# EAGLE design controler (EAGLE 5.10)
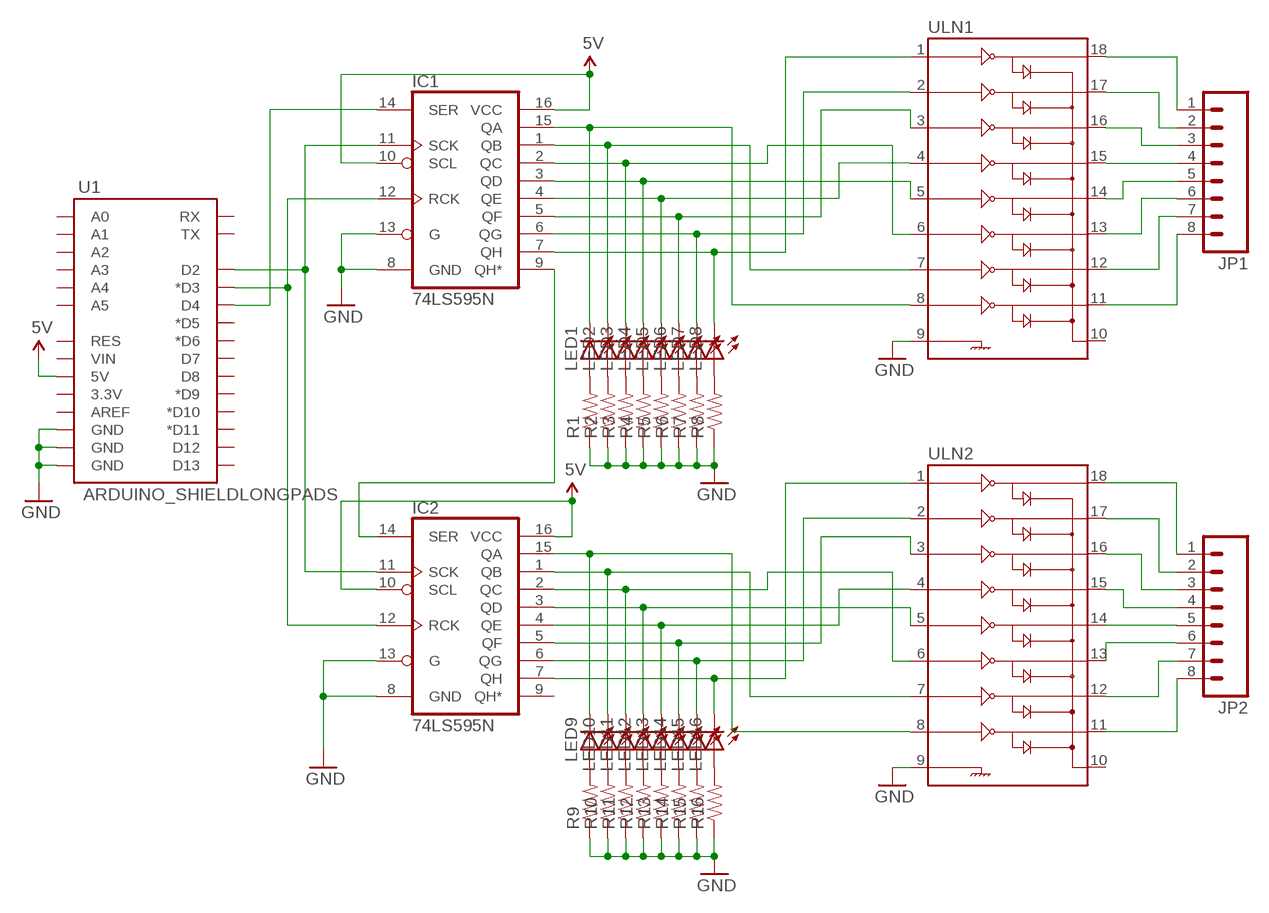
[diagram p0: schematic, sheet 1]

## Parts
IC1  74LS595N  [DIL16]
IC2  74LS595N  [DIL16]
JP1  M08  [1X08]
JP2  M08  [1X08]
LED1  LEDCHIPLED_0805  [CHIPLED_0805]
LED2  LEDCHIPLED_0805  [CHIPLED_0805]
LED3  LEDCHIPLED_0805  [CHIPLED_0805]
LED4  LEDCHIPLED_0805  [CHIPLED_0805]
LED5  LEDCHIPLED_0805  [CHIPLED_0805]
LED6  LEDCHIPLED_0805  [CHIPLED_0805]
LED7  LEDCHIPLED_0805  [CHIPLED_0805]
LED8  LEDCHIPLED_0805  [CHIPLED_0805]
LED9  LEDCHIPLED_0805  [CHIPLED_0805]
LED10  LEDCHIPLED_0805  [CHIPLED_0805]
LED11  LEDCHIPLED_0805  [CHIPLED_0805]
LED12  LEDCHIPLED_0805  [CHIPLED_0805]
LED13  LEDCHIPLED_0805  [CHIPLED_0805]
LED14  LEDCHIPLED_0805  [CHIPLED_0805]
LED15  LEDCHIPLED_0805  [CHIPLED_0805]
LED16  LEDCHIPLED_0805  [CHIPLED_0805]
R1  RESISTOR  [0805]
R2  RESISTOR  [0805]
R3  RESISTOR  [0805]
R4  RESISTOR  [0805]
R5  RESISTOR  [0805]
R6  RESISTOR  [0805]
R7  RESISTOR  [0805]
R8  RESISTOR  [0805]
R9  RESISTOR  [0805]
R10  RESISTOR  [0805]
R11  RESISTOR  [0805]
R12  RESISTOR  [0805]
R13  RESISTOR  [0805]
R14  RESISTOR  [0805]
R15  RESISTOR  [0805]
R16  RESISTOR  [0805]
U1  ARDUINO_SHIELDLONGPADS  [DUEMILANOVE_SHIELD_LONGPADS]
ULN1  ULN2803DIP  [DIL18]
ULN2  ULN2803DIP  [DIL18]

## Nets
5V: IC1.10(SCL) IC1.16(VCC) IC2.10(SCL) IC2.16(VCC) U1.5V
GND: IC1.8(GND) IC1.13(G) IC2.8(GND) IC2.13(G) R1.1 R2.1 R3.1 R4.1 R5.1 R6.1 R7.1 R8.1 R9.1 R10.1 R11.1 R12.1 R13.1 R14.1 R15.1 R16.1 U1.GND@0(GND) U1.GND@1(GND) U1.GND@2(GND) ULN1.9 ULN2.9
N$1: IC1.7(QH) LED8.C ULN1.1
N$2: IC1.6(QG) LED7.C ULN1.2
N$3: IC1.5(QF) LED6.C ULN1.3
N$4: IC1.4(QE) LED5.C ULN1.4
N$5: IC1.3(QD) LED4.C ULN1.5
N$6: IC1.2(QC) LED3.C ULN1.6
N$7: IC1.1(QB) LED2.C ULN1.7
N$8: IC1.15(QA) LED1.C ULN1.8
N$9: IC1.9(QH*) IC2.14(SER)
N$14: IC1.11(SCK) IC2.11(SCK) U1.D2
N$19: JP1.1 ULN1.18
N$20: JP1.2 ULN1.17
N$21: IC1.12(RCK) IC2.12(RCK) U1.D3(*D3)
N$22: IC1.14(SER) U1.D4
N$23: JP1.3 ULN1.16
N$24: JP1.4 ULN1.15
N$25: JP1.5 ULN1.14
N$26: JP1.6 ULN1.13
N$27: JP1.7 ULN1.12
N$28: JP1.8 ULN1.11
N$29: JP2.1 ULN2.18
N$30: JP2.2 ULN2.17
N$31: JP2.3 ULN2.16
N$32: JP2.4 ULN2.15
N$33: JP2.5 ULN2.14
N$34: JP2.8 ULN2.11
N$35: JP2.7 ULN2.12
N$36: JP2.6 ULN2.13
N$37: LED1.A R1.2
N$38: LED2.A R2.2
N$39: LED3.A R3.2
N$40: LED4.A R4.2
N$41: LED5.A R5.2
N$42: LED6.A R6.2
N$43: LED7.A R7.2
N$44: LED8.A R8.2
N$45: IC2.7(QH) LED16.C ULN2.1
N$46: IC2.6(QG) LED15.C ULN2.2
N$47: IC2.5(QF) LED14.C ULN2.3
N$48: IC2.4(QE) LED13.C ULN2.4
N$49: IC2.3(QD) LED12.C ULN2.5
N$50: IC2.2(QC) LED11.C ULN2.6
N$51: IC2.1(QB) LED10.C ULN2.7
N$52: IC2.15(QA) LED9.C ULN2.8
N$53: LED9.A R9.2
N$54: LED10.A R10.2
N$55: LED11.A R11.2
N$56: LED12.A R12.2
N$57: LED13.A R13.2
N$58: LED14.A R14.2
N$59: LED15.A R15.2
N$60: LED16.A R16.2
Unconnected: IC2.9(QH*) U1.3.3V U1.A0 U1.A1 U1.A2 U1.A3 U1.A4 U1.A5 U1.AREF U1.D5(*D5) U1.D6(*D6) U1.D7 U1.D8 U1.D9(*D9) U1.D10(*D10) U1.D11(*D11) U1.D12 U1.D13 U1.RES U1.RX U1.TX U1.VIN ULN1.10 ULN2.10

## Library data of the parts
IC1 IC2 = SparkFun:74*595: 8-bit SHIFT REGISTER, output latch
JP1 JP2 = SparkFun:M08: Header 8 Standard 8-pin 0.1" header. Use with straight break away headers (SKU : PRT-00116), right angle break away headers (PRT-00553), swiss pins (PRT-00743), machine pins (PRT-00117), and female headers (PRT-00115).
LED1-LED16 = led:LED: LED OSRAM: - CHIPLED LG R971, LG N971, LY N971, LG Q971, LY Q971, LO R971, LY R971 LH N974, LH R974 LS Q976, LO Q976, LY Q976 LO Q996 - Hyper CHIPLED LW Q18S LB Q993, LB Q99A, LB R99A - SideLED LS A670, LO A670, LY A670, LG A670, LP A670 LB A673, LV A673, LT A673, LW A673 LH A674 LY A675 LS A676, LA A676, LO A676, LY A676, LW A676 LS A679, LY A679, LG A679 - Hyper Micro SIDELED® LS Y876, LA Y876, LO Y876, LY Y876 LT Y87S - SmartLED LW L88C, LW L88S LB L89C, LB L89S, LG L890 LS L89K, LO L89K, LY L89K LS L896, LA L896, LO L896, LY L896 - TOPLED LS T670, LO T670, LY T670, LG T670, LP T670 LSG T670, LSP T670, LSY T670, LOP T670, LYG T670 LG T671, LOG T671, LSG T671 LB T673, LV T673, LT T673, LW T673 LH T674 LS T676, LA T676, LO T676, LY T676, LB T676, LH T676, LSB T676, LW T676 LB T67C, LV T67C, LT T67C, LS T67K, LO T67K, LY T67K, LW E67C LS E67B, LA E67B, LO E67B, LY E67B, LB E67C, LV E67C, LT E67C LW T67C LS T679, LY T679, LG T679 LS T770, LO T770, LY T770, LG T770, LP T770 LB T773, LV T773, LT T773, LW T773 LH T774 LS E675, LA E675, LY E675, LS T675 LS T776, LA T776, LO T776, LY T776, LB T776 LHGB T686 LT T68C, LB T68C - Hyper Mini TOPLED® LB M676 - Mini TOPLED Santana® LG M470 LS M47K, LO M47K, LY M47K Source: http://www.osram.convergy.de LUXEON: - LUMILED® LXK2-PW12-R00, LXK2-PW12-S00, LXK2-PW14-U00, LXK2-PW14-V00 LXK2-PM12-R00, LXK2-PM12-S00, LXK2-PM14-U00 LXK2-PE12-Q00, LXK2-PE12-R00, LXK2-PE12-S00, LXK2-PE14-T00, LXK2-PE14-U00 LXK2-PB12-K00, LXK2-PB12-L00, LXK2-PB12-M00, LXK2-PB14-N00, LXK2-PB14-P00, LXK2-PB14-Q00 LXK2-PR12-L00, LXK2-PR12-M00, LXK2-PR14-Q00, LXK2-PR14-R00 LXK2-PD12-Q00, LXK2-PD12-R00, LXK2-PD12-S00 LXK2-PH12-R00, LXK2-PH12-S00 LXK2-PL12-P00, LXK2-PL12-Q00, LXK2-PL12-R00 Source: www.luxeon.com KINGBRIGHT: KA-3528ASYC Source: www.kingbright.com
R1-R16 = SparkFun:RESISTOR: Resistor Basic schematic elements and footprints for 0603, 1206, and PTH 1/10th watt (small) resistors.
U1 = SparkFun:ARDUINO_SHIELD
ULN1 ULN2 = SparkFun:ULN2803: Darlington Driver ULN2803 Darlington array. 500mA max per channel, 8-channel package. Spark Fun Electronics SKU : COM-00312

## Board
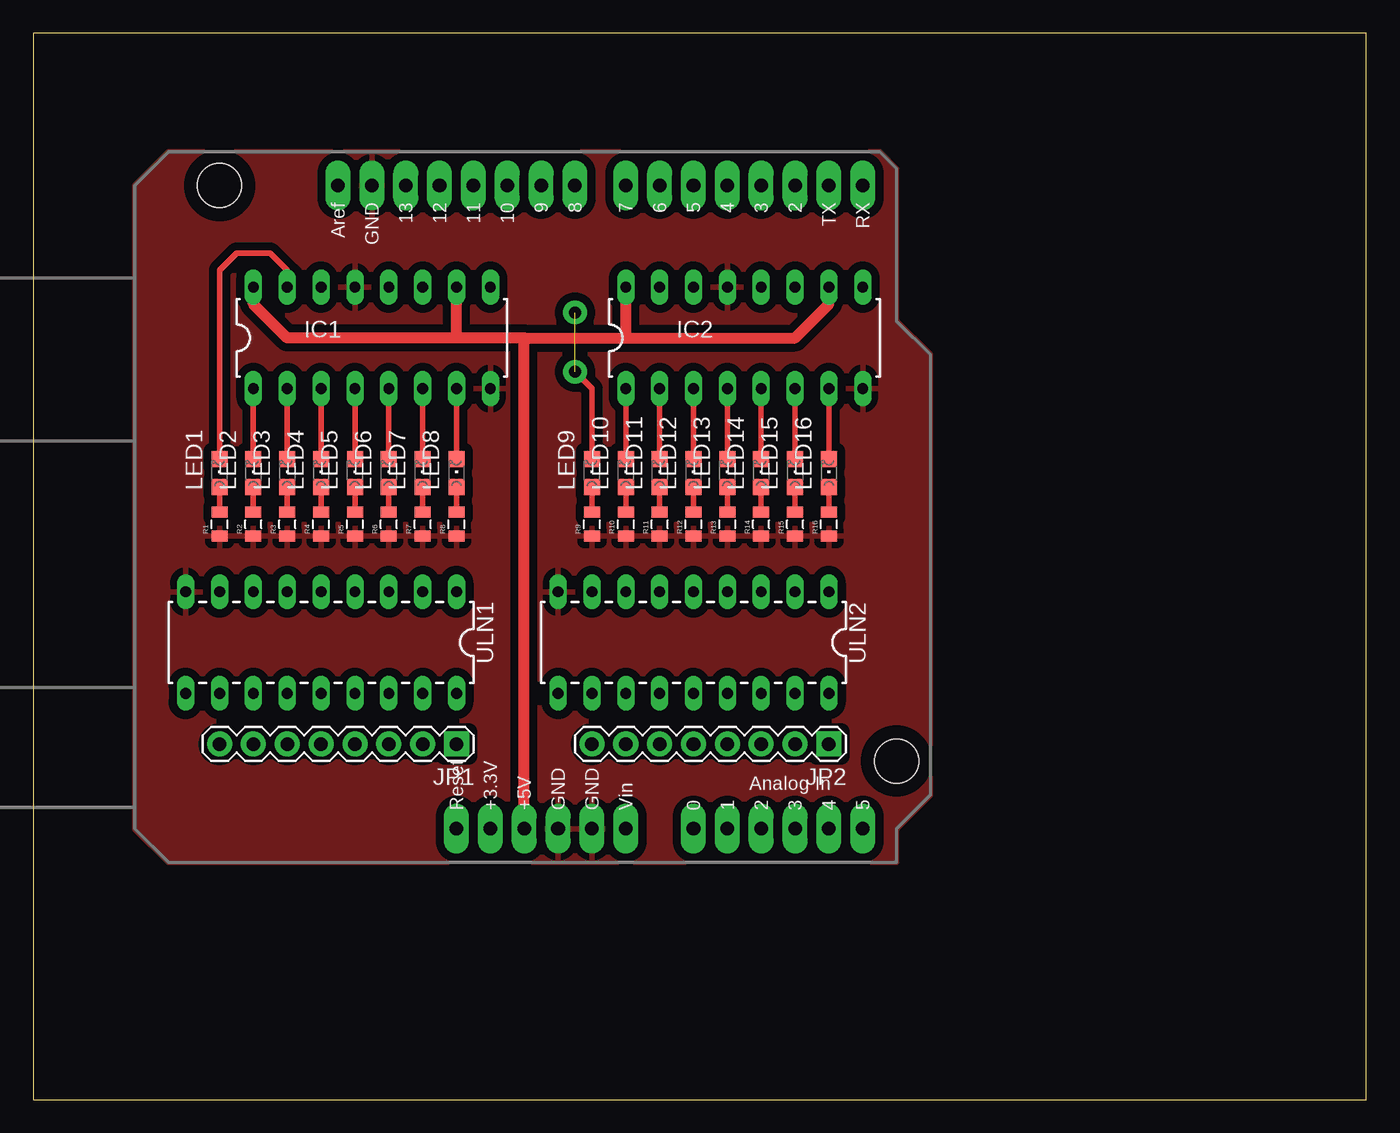
[diagram p1: board, top side]
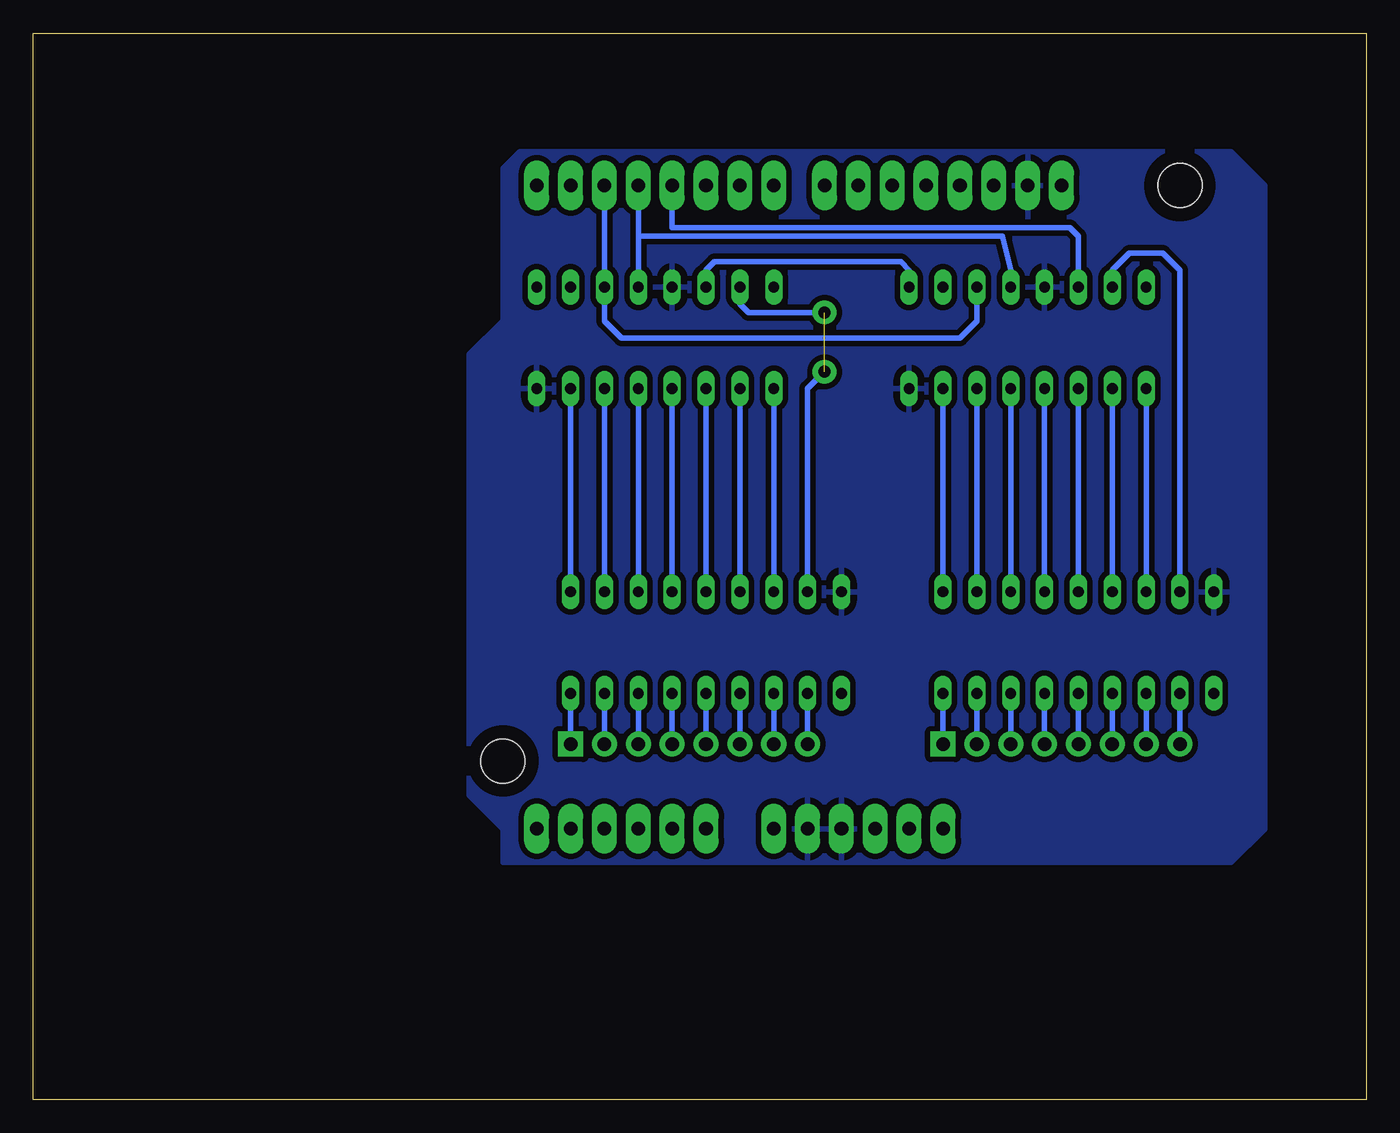
[diagram p2: board, bottom side, seen from below]

Size 100 x 80 mm. Coordinates in mm from the lower left corner, seen from the top.
Outline: 0,0 100,0 100,80 0,80 0,0
Copper layers (1*16): Top 0.035mm / dielectric 1.5mm / Bottom 0.035mm
Design rules "LWK PCB Home *": minimum track width 10mil, minimum drill 24mil, track to track 10mil, track to pad 10mil, pad to pad 10mil, via to via 8mil, smd to smd 10mil, copper to edge 40mil, drill to drill 8mil, minimum pad ring 10mil, minimum via ring 8mil, stop-mask expansion 4mil, vias tented up to drill 0mil, thermal gap 20mil

### Footprints (pad centres in the part's own frame; a part is rotated, then mirrored left to right if it is on the bottom)
DIL16 = drill 0.813 long: 1 -8.89,-3.81; 2 -6.35,-3.81; 3 -3.81,-3.81; 4 -1.27,-3.81; 5 1.27,-3.81; 6 3.81,-3.81; 7 6.35,-3.81; 8 8.89,-3.81; 9 8.89,3.81; 10 6.35,3.81; 11 3.81,3.81; 12 1.27,3.81; 13 -1.27,3.81; 14 -3.81,3.81; 15 -6.35,3.81; 16 -8.89,3.81
1X08 = drill 1.016 pad 1.88 square: 1 0,0 | drill 1.016 pad 1.88 round: 2 2.54,0; 3 5.08,0; 4 7.62,0; 5 10.16,0; 6 12.7,0; 7 15.24,0; 8 17.78,0
CHIPLED_0805 = smd 1.2 x 1.2: A 0,-1.05; C 0,1.05
0805 = smd 0.8 x 1.2: 1 -0.9,0; 2 0.9,0
DUEMILANOVE_SHIELD_LONGPADS = drill 1.016 pad 1.88 long: 3.3V 50.8,26.67; 5V 50.8,29.21; A0 50.8,41.91; A1 50.8,44.45; A2 50.8,46.99; A3 50.8,49.53; A4 50.8,52.07; A5 50.8,54.61; AREF 2.54,15.24; D2 2.54,49.53; D3 2.54,46.99; D4 2.54,44.45; D5 2.54,41.91; D6 2.54,39.37; D7 2.54,36.83; D8 2.54,33.02; D9 2.54,30.48; D10 2.54,27.94; D11 2.54,25.4; D12 2.54,22.86; D13 2.54,20.32; GND@0 50.8,31.75; GND@1 50.8,34.29; GND@2 2.54,17.78; RES 50.8,24.13; RX 2.54,54.61; TX 2.54,52.07; VIN 50.8,36.83 | hole 3.302: 45.72,57.15; 2.54,6.35
DIL18 = drill 0.813 long: 1 -10.16,-3.81; 2 -7.62,-3.81; 3 -5.08,-3.81; 4 -2.54,-3.81; 5 0,-3.81; 6 2.54,-3.81; 7 5.08,-3.81; 8 7.62,-3.81; 9 10.16,-3.81; 10 10.16,3.81; 11 7.62,3.81; 12 5.08,3.81; 13 2.54,3.81; 14 0,3.81; 15 -2.54,3.81; 16 -5.08,3.81; 17 -7.62,3.81; 18 -10.16,3.81

### Placement (x,y rotation side)
IC1  25.4,57.15 0 top
IC2  53.34,57.15 0 top
JP1  31.75,26.67 180 top
JP2  59.69,26.67 180 top
LED1  13.97,46.99 0 top
LED2  16.51,46.99 0 top
LED3  19.05,46.99 0 top
LED4  21.59,46.99 0 top
LED5  24.13,46.99 0 top
LED6  26.67,46.99 0 top
LED7  29.21,46.99 0 top
LED8  31.75,46.99 0 top
LED9  41.91,46.99 0 top
LED10  44.45,46.99 0 top
LED11  46.99,46.99 0 top
LED12  49.53,46.99 0 top
LED13  52.07,46.99 0 top
LED14  54.61,46.99 0 top
LED15  57.15,46.99 0 top
LED16  59.69,46.99 0 top
R1  13.97,43.18 90 top
R2  16.51,43.18 90 top
R3  19.05,43.18 90 top
R4  21.59,43.18 90 top
R5  24.13,43.18 90 top
R6  26.67,43.18 90 top
R7  29.21,43.18 90 top
R8  31.75,43.18 90 top
R9  41.91,43.18 90 top
R10  44.45,43.18 90 top
R11  46.99,43.18 90 top
R12  49.53,43.18 90 top
R13  52.07,43.18 90 top
R14  54.61,43.18 90 top
R15  57.15,43.18 90 top
R16  59.69,43.18 90 top
U1  7.62,71.12 270 top
ULN1  21.59,34.29 180 top
ULN2  49.53,34.29 180 top

### Tracks (layer width: path | path; a pad name or v marks a point on that pad's centre or on a via)
5V
  Top 0.813: U1.5V 36.83,57.15 | 36.83,57.15 31.75,57.15 | 31.75,57.15 19.05,57.15 16.51,59.69 IC1.16 | 31.75,57.15 IC1.10 | 36.83,57.15 44.45,57.15 | 44.45,57.15 57.15,57.15 59.69,59.69 IC2.10 | 44.45,57.15 IC2.16
GND
  pour Bottom (isolate 0.406): 10.16,71.12 7.62,68.58 7.62,20.32 10.16,17.78 64.77,17.78 64.77,20.32 67.31,22.86 67.31,55.88 64.77,58.42 64.77,69.85 63.5,71.12
  pour Top (isolate 0.61): 10.16,71.12 7.62,68.58 7.62,20.32 10.16,17.78 64.77,17.78 64.77,20.32 67.31,22.86 67.31,55.88 64.77,58.42 64.77,69.85 63.5,71.12
N$1
  Top 0.406: IC1.7 LED8.C
  Bottom 0.406: ULN1.1 IC1.7
N$2
  Top 0.406: IC1.6 LED7.C
  Bottom 0.406: ULN1.2 IC1.6
N$3
  Top 0.406: IC1.5 LED6.C
  Bottom 0.406: ULN1.3 IC1.5
N$4
  Top 0.406: IC1.4 LED5.C
  Bottom 0.406: ULN1.4 IC1.4
N$5
  Top 0.406: IC1.3 LED4.C
  Bottom 0.406: ULN1.5 IC1.3
N$6
  Top 0.406: IC1.2 LED3.C
  Bottom 0.406: ULN1.6 IC1.2
N$7
  Top 0.406: IC1.1 LED2.C
  Bottom 0.406: ULN1.7 IC1.1
N$8
  Top 0.406: LED1.C 13.97,62.23 15.24,63.5 17.78,63.5 19.05,62.23 IC1.15
  Bottom 0.406: ULN1.8 13.97,62.23 15.24,63.5 17.78,63.5 19.05,62.23 IC1.15
N$9
  Bottom 0.406: IC1.9 34.29,62.23 34.92,62.87 48.9,62.87 49.53,62.23 IC2.14
N$14
  Bottom 0.406: U1.D2 IC2.11 57.15,58.42 55.88,57.15 30.48,57.15 29.21,58.42 IC1.11
N$19
  Bottom 0.406: JP1.1 ULN1.18
N$20
  Bottom 0.406: JP1.2 ULN1.17
N$21
  Bottom 0.406: IC1.12 26.67,62.23 27.3,64.77 54.61,64.77 | 54.61,64.77 IC2.12 | 54.61,64.77 U1.D3
N$22
  Bottom 0.406: U1.D4 52.07,65.41 22.23,65.41 21.59,64.77 IC1.14
N$23
  Bottom 0.406: JP1.3 ULN1.16
N$24
  Bottom 0.406: JP1.4 ULN1.15
N$25
  Bottom 0.406: JP1.5 ULN1.14
N$26
  Bottom 0.406: JP1.6 ULN1.13
N$27
  Bottom 0.406: JP1.7 ULN1.12
N$28
  Bottom 0.406: JP1.8 ULN1.11
N$29
  Bottom 0.406: JP2.1 ULN2.18
N$30
  Bottom 0.406: JP2.2 ULN2.17
N$31
  Bottom 0.406: JP2.3 ULN2.16
N$32
  Bottom 0.406: JP2.4 ULN2.15
N$33
  Bottom 0.406: JP2.5 ULN2.14
N$34
  Bottom 0.406: JP2.8 ULN2.11
N$35
  Bottom 0.406: JP2.7 ULN2.12
N$36
  Bottom 0.406: JP2.6 ULN2.13
N$37
  Top 0.406: R1.2 LED1.A
N$38
  Top 0.406: R2.2 LED2.A
N$39
  Top 0.406: R3.2 LED3.A
N$40
  Top 0.406: R4.2 LED4.A
N$41
  Top 0.406: R5.2 LED5.A
N$42
  Top 0.406: R6.2 LED6.A
N$43
  Top 0.406: R7.2 LED7.A
N$44
  Top 0.406: R8.2 LED8.A
N$45
  Top 0.406: IC2.7 LED16.C
  Bottom 0.406: ULN2.1 IC2.7
N$46
  Top 0.406: IC2.6 LED15.C
  Bottom 0.406: 57.15,39.37 ULN2.2 IC2.6
N$47
  Top 0.406: IC2.5 LED14.C
  Bottom 0.406: ULN2.3 IC2.5
N$48
  Top 0.406: IC2.4 LED13.C
  Bottom 0.406: ULN2.4 IC2.4
N$49
  Top 0.406: IC2.3 LED12.C
  Bottom 0.406: ULN2.5 IC2.3
N$50
  Top 0.406: IC2.2 LED11.C
  Bottom 0.406: 46.99,39.37 ULN2.6 IC2.2
N$51
  Top 0.406: IC2.1 LED10.C
  Bottom 0.406: ULN2.7 IC2.1
N$52  (via drill 0.9 pad 1.78)  (1 unrouted)
  Top 0.406: v40.64,54.61 41.91,53.34 LED9.C
  Bottom 0.406: IC2.15 46.99,59.69 46.35,59.05 v40.64,59.05 | ULN2.8 41.91,53.34 v40.64,54.61
N$53
  Top 0.406: R9.2 LED9.A
N$54
  Top 0.406: R10.2 LED10.A
N$55
  Top 0.406: R11.2 LED11.A
N$56
  Top 0.406: R12.2 LED12.A
N$57
  Top 0.406: R13.2 LED13.A
N$58
  Top 0.406: R14.2 LED14.A
N$59
  Top 0.406: R15.2 LED15.A
N$60
  Top 0.406: R16.2 LED16.A